# Altium project Fly&Dive.PrjPCB
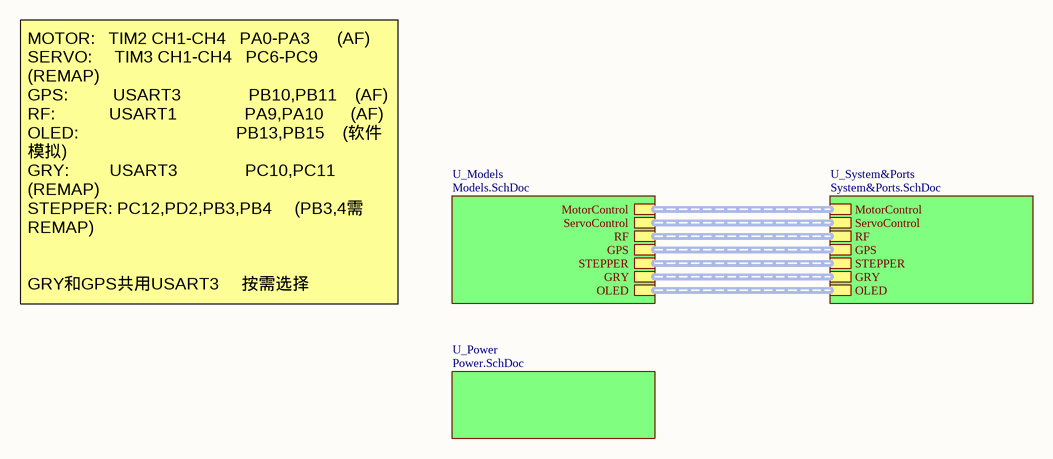
[diagram p0: Board.SchDoc]
4 sheets, 41 parts. Net scope: hierarchical (ports join the sheet entries above them; power ports are global).
Board file: FlyAndDive.PcbDoc
Sheets:
  Board.SchDoc
    U_Models = Models.SchDoc
    U_System&Ports = System&Ports.SchDoc
    U_Power = Power.SchDoc

## Sheet Board.SchDoc
size A4

### Sub-sheets
U_Models = Models.SchDoc: MotorControl (harness MOTOR), ServoControl (harness SERO), RF (harness RF), GPS (harness GPS), STEPPER (harness STEPPER), GRY (harness GRY), OLED (harness OLED)
U_Power = Power.SchDoc: no entries
U_System&Ports = System&Ports.SchDoc: MotorControl (harness MOTOR), ServoControl (harness SERO), RF (harness RF), GPS (harness GPS), STEPPER (harness STEPPER), GRY (harness GRY), OLED (harness OLED)

### Buses and harness runs
harness sheet U_Models/GPS = sheet U_System&Ports/GPS
harness sheet U_Models/GRY = sheet U_System&Ports/GRY
harness sheet U_Models/MotorControl = sheet U_System&Ports/MotorControl
harness sheet U_Models/OLED = sheet U_System&Ports/OLED
harness sheet U_Models/RF = sheet U_System&Ports/RF
harness sheet U_Models/ServoControl = sheet U_System&Ports/ServoControl
harness sheet U_Models/STEPPER = sheet U_System&Ports/STEPPER

### Notes on the sheet
- MOTOR:   TIM2 CH1-CH4   PA0-PA3      (AF)
  SERVO:     TIM3 CH1-CH4   PC6-PC9      (REMAP)
  GPS:          USART3               PB10,PB11    (AF)
  RF:            USART1               PA9,PA10      (AF)
  OLED:                                   PB13,PB15    (软件模拟)
  GRY:         USART3               PC10,PC11  (REMAP)
  STEPPER: PC12,PD2,PB3,PB4     (PB3,4需REMAP)
  GRY和GPS共用USART3     按需选择

## Sheet Models.SchDoc
size A4
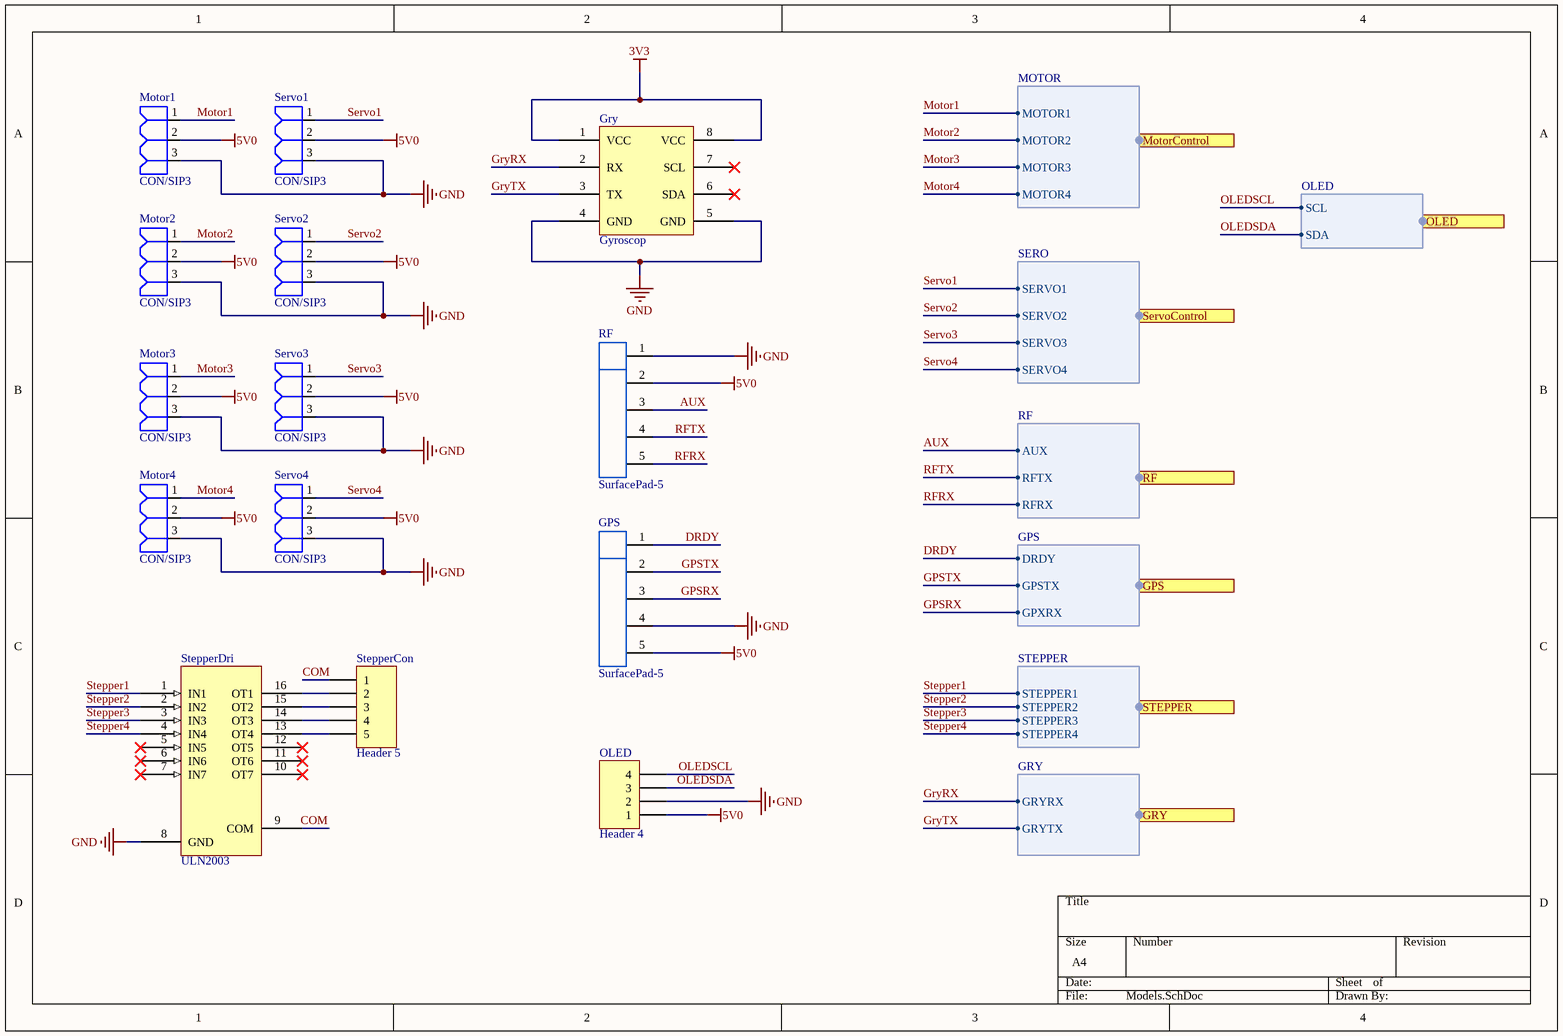
[diagram p1: Models.SchDoc]

### Parts
GPS  SurfacePad-5  [SurfacePad-5]
Gry  Gyroscop  [串口陀螺仪]
Motor1  CON/SIP3  [HDR1X3]
Motor2  CON/SIP3  [HDR1X3]
Motor3  CON/SIP3  [HDR1X3]
Motor4  CON/SIP3  [HDR1X3]
OLED  Header 4  [HDR1X4]
RF  SurfacePad-5  [SurfacePad-5]
Servo1  CON/SIP3  [HDR1X3]
Servo2  CON/SIP3  [HDR1X3]
Servo3  CON/SIP3  [HDR1X3]
Servo4  CON/SIP3  [HDR1X3]
StepperCon  Header 5  [HDR1X5]
StepperDri  ULN2003  [SOIC16]

### Ports
GPS (harness GPS), GRY (harness GRY), MotorControl (harness MOTOR), OLED (harness OLED), RF (harness RF), ServoControl (harness SERO), STEPPER (harness STEPPER)

### Harnesses
MOTOR: MOTOR1, MOTOR2, MOTOR3, MOTOR4
SERO: SERVO1, SERVO2, SERVO3, SERVO4
RF: AUX, RFTX, RFRX
GPS: DRDY, GPSTX, GPXRX
STEPPER: STEPPER1, STEPPER2, STEPPER3, STEPPER4
GRY: GRYRX, GRYTX
OLED: SCL, SDA

### Nets
3V3: Gry.1(VCC) Gry.8(VCC)
5V0: GPS.5 Motor1.2 Motor2.2 Motor3.2 Motor4.2 OLED.1 RF.2 Servo1.2 Servo2.2 Servo3.2 Servo4.2
GND: GPS.4 Gry.4(GND) Gry.5(GND) Motor1.3 Motor2.3 Motor3.3 Motor4.3 OLED.2 RF.1 Servo1.3 Servo2.3 Servo3.3 Servo4.3 StepperDri.8(GND)
AUX: RF.3 ; port RF.AUX
COM: StepperCon.1 StepperDri.9(COM)
DRDY: GPS.1 ; port GPS.DRDY
GPSRX: GPS.3 ; port GPS.GPXRX
GPSTX: GPS.2 ; port GPS.GPSTX
GryRX: Gry.2(RX) ; port GRY.GRYRX
GryTX: Gry.3(TX) ; port GRY.GRYTX
Motor1: Motor1.1 ; port MotorControl.MOTOR1
Motor2: Motor2.1 ; port MotorControl.MOTOR2
Motor3: Motor3.1 ; port MotorControl.MOTOR3
Motor4: Motor4.1 ; port MotorControl.MOTOR4
OLEDSCL: OLED.4 ; port OLED.SCL
OLEDSDA: OLED.3 ; port OLED.SDA
RFRX: RF.5 ; port RF.RFRX
RFTX: RF.4 ; port RF.RFTX
Servo1: Servo1.1 ; port ServoControl.SERVO1
Servo2: Servo2.1 ; port ServoControl.SERVO2
Servo3: Servo3.1 ; port ServoControl.SERVO3
Servo4: Servo4.1 ; port ServoControl.SERVO4
Stepper1: StepperDri.1(IN1) ; port STEPPER.STEPPER1
Stepper2: StepperDri.2(IN2) ; port STEPPER.STEPPER2
Stepper3: StepperDri.3(IN3) ; port STEPPER.STEPPER3
Stepper4: StepperDri.4(IN4) ; port STEPPER.STEPPER4
NetStepperCon_2: StepperCon.2 StepperDri.16(OT1)
NetStepperCon_3: StepperCon.3 StepperDri.15(OT2)
NetStepperCon_4: StepperCon.4 StepperDri.14(OT3)
NetStepperCon_5: StepperCon.5 StepperDri.13(OT4)

Not connected (* = marked no-connect by the designer): Gry 6(SDA)* 7(SCL)*; StepperDri 5(IN5)* 6(IN6)* 7(IN7)* 10(OT7)* 11(OT6)* 12(OT5)*

### Library data of the parts
Gry = 串口陀螺仪
OLED = Header 4: Header, 4-Pin; LatestRevisionDate: 17-Jul-2002; LatestRevisionNote: Re-released for DXP Platform.; Publisher: Altium Limited
StepperCon = Header 5: Header, 5-Pin; LatestRevisionDate: 17-Jul-2002; LatestRevisionNote: Re-released for DXP Platform.; Publisher: Altium Limited
StepperDri = ULN2003: 驱动IC

## Sheet System&Ports.SchDoc
size A4
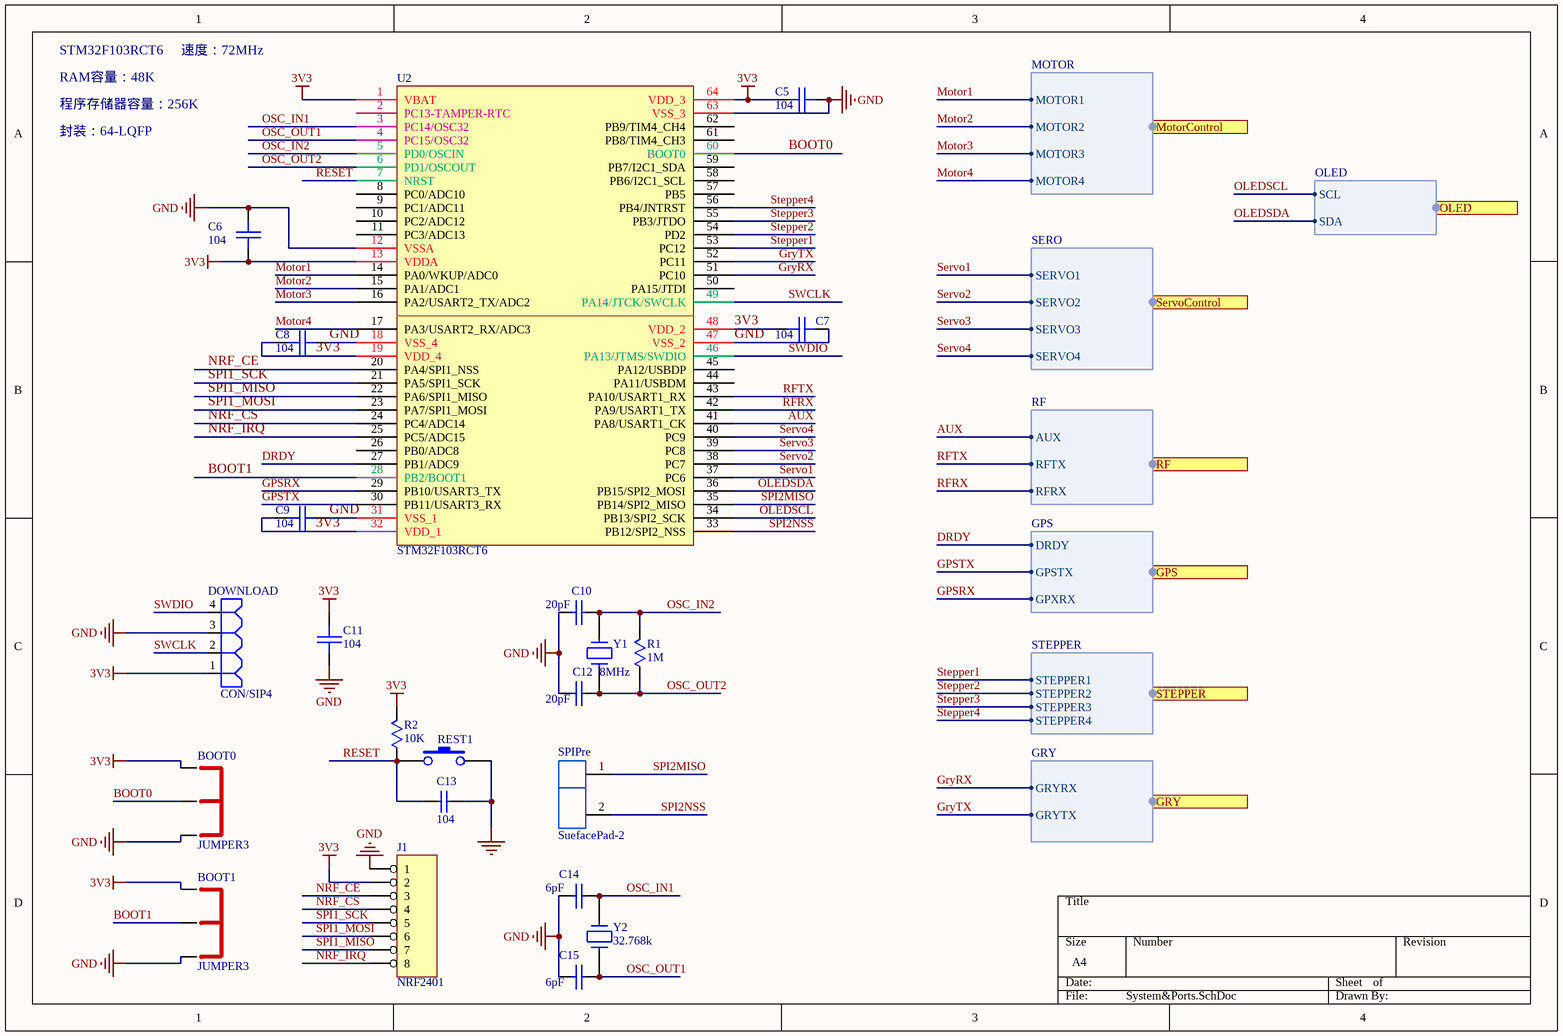
[diagram p2: System&Ports.SchDoc]

### Parts
BOOT0  JUMPER3  [Jumper3]
BOOT1  JUMPER3  [Jumper3]
C5  104  [C0603]
C6  104  [C0603]
C7  104  [C0603]
C8  104  [C0603]
C9  104  [C0603]
C10  20pF  [LC-0603_C]
C11  104  [C0603]
C12  20pF  [LC-0603_C]
C13  104  [LC-0603_C]
C14  6pF  [LC-0603_C]
C15  6pF  [LC-0603_C]
DOWNLOAD  CON/SIP4  [HDR1X4]
J1  NRF2401  [HDR2X4]
R1  1M  [LC-0603_R]
R2  10K  [R0603]
REST1  (no value)  [KEY-K2]
SPIPre  SuefacePad-2  [SurfacePad-2]
U2  STM32F103RCT6  [LC-LQFP-64_10x10x05P]
Y1  8MHz  [XTAL-49/S_N]
Y2  32.768k  [XTAL_2X6 卧式]

### Ports
GPS (harness GPS), GRY (harness GRY), MotorControl (harness MOTOR), OLED (harness OLED), RF (harness RF), ServoControl (harness SERO), STEPPER (harness STEPPER)

### Harnesses
MOTOR: MOTOR1, MOTOR2, MOTOR3, MOTOR4
SERO: SERVO1, SERVO2, SERVO3, SERVO4
RF: AUX, RFTX, RFRX
GPS: DRDY, GPSTX, GPXRX
STEPPER: STEPPER1, STEPPER2, STEPPER3, STEPPER4
GRY: GRYRX, GRYTX
OLED: SCL, SDA

### Nets
3V3: BOOT0.1 BOOT1.1 C5.1 C6.2 C7.1 C8.1 C9.1 C11.1 DOWNLOAD.1 J1.2 R2.2 U2.1(VBAT) U2.13(VDDA) U2.19(VDD_4) U2.32(VDD_1) U2.48(VDD_2) U2.64(VDD_3)
GND: BOOT0.3 BOOT1.3 C5.2 C6.1 C7.2 C8.2 C9.2 C10.1 C11.2 C12.1 C13.1 C14.1 C15.1 DOWNLOAD.3 J1.1 REST1.2 U2.12(VSSA) U2.18(VSS_4) U2.31(VSS_1) U2.47(VSS_2) U2.63(VSS_3)
AUX: U2.41(PA8/USART1_CK) ; port RF.AUX
BOOT0: BOOT0.2 U2.60(BOOT0)
BOOT1: BOOT1.2 U2.28(PB2/BOOT1)
DRDY: U2.27(PB1/ADC9) ; port GPS.DRDY
GPSRX: U2.29(PB10/USART3_TX) ; port GPS.GPXRX
GPSTX: U2.30(PB11/USART3_RX) ; port GPS.GPSTX
GryRX: U2.51(PC10) ; port GRY.GRYRX
GryTX: U2.52(PC11) ; port GRY.GRYTX
Motor1: U2.14(PA0/WKUP/ADC0) ; port MotorControl.MOTOR1
Motor2: U2.15(PA1/ADC1) ; port MotorControl.MOTOR2
Motor3: U2.16(PA2/USART2_TX/ADC2) ; port MotorControl.MOTOR3
Motor4: U2.17(PA3/USART2_RX/ADC3) ; port MotorControl.MOTOR4
NRF_CE: J1.3 U2.20(PA4/SPI1_NSS)
NRF_CS: J1.4 U2.24(PC4/ADC14)
NRF_IRQ: J1.8 U2.25(PC5/ADC15)
OLEDSCL: U2.34(PB13/SPI2_SCK) ; port OLED.SCL
OLEDSDA: U2.36(PB15/SPI2_MOSI) ; port OLED.SDA
OSC_IN1: C14.2 U2.3(PC14/OSC32) Y2.2
OSC_IN2: C10.2 R1.2 U2.5(PD0/OSCIN) Y1.1
OSC_OUT1: C15.2 U2.4(PC15/OSC32) Y2.1
OSC_OUT2: C12.2 R1.1 U2.6(PD1/OSCOUT) Y1.2
RESET: C13.2 R2.1 REST1.1 U2.7(NRST)
RFRX: U2.42(PA9/USART1_TX) ; port RF.RFRX
RFTX: U2.43(PA10/USART1_RX) ; port RF.RFTX
Servo1: U2.37(PC6) ; port ServoControl.SERVO1
Servo2: U2.38(PC7) ; port ServoControl.SERVO2
Servo3: U2.39(PC8) ; port ServoControl.SERVO3
Servo4: U2.40(PC9) ; port ServoControl.SERVO4
SPI1_MISO: J1.7 U2.22(PA6/SPI1_MISO)
SPI1_MOSI: J1.6 U2.23(PA7/SPI1_MOSI)
SPI1_SCK: J1.5 U2.21(PA5/SPI1_SCK)
SPI2MISO: SPIPre.1 U2.35(PB14/SPI2_MISO)
SPI2NSS: SPIPre.2 U2.33(PB12/SPI2_NSS)
Stepper1: U2.53(PC12) ; port STEPPER.STEPPER1
Stepper2: U2.54(PD2) ; port STEPPER.STEPPER2
Stepper3: U2.55(PB3/JTDO) ; port STEPPER.STEPPER3
Stepper4: U2.56(PB4/JNTRST) ; port STEPPER.STEPPER4
SWCLK: DOWNLOAD.2 U2.49(PA14/JTCK/SWCLK)
SWDIO: DOWNLOAD.4 U2.46(PA13/JTMS/SWDIO)

Not connected (* = marked no-connect by the designer): U2 2(PC13-TAMPER-RTC) 8(PC0/ADC10) 9(PC1/ADC11) 10(PC2/ADC12) 11(PC3/ADC13) 26(PB0/ADC8) 44(PA11/USBDM) 45(PA12/USBDP) 50(PA15/JTDI) 57(PB5) 58(PB6/I2C1_SCL) 59(PB7/I2C1_SDA) 61(PB8/TIM4_CH3) 62(PB9/TIM4_CH4)

### Notes on the sheet
- STM32F103RCT6
- 程序存储器容量：256K
- RAM容量：48K
- 速度：72MHz
- 封装：64-LQFP

### Library data of the parts
BOOT0 BOOT1 = JUMPER3: Jumper
C5-C9 C11 = CAP
C10 C12 = CAP: CAP CHIP 20P 50V(+-5% C0G 0603); Value: 20pF
C13 = CAP: GRM39 X7R102K50PT; Value: 100pF; Published: 8-Jun-2000; Revision: July-2002: Re-released for DXP Platform.; Publisher: Altium Limited; REF: GRM39 X7R102K50PT
C14 C15 = CAP: CAP CHIP 20P 50V(+-5% C0G 0603); Value: 20pF
J1 = HEADER 8: 8 Pin Header
R1 R2 = RES
REST1 = SW-PB
SPIPre = SurfacePad-2
U2 = STM32F103RBT6
Y1 Y2 = CRYSTAL: Crystal 8MHz PLUG; Value: 8MHz

## Sheet Power.SchDoc
size A4
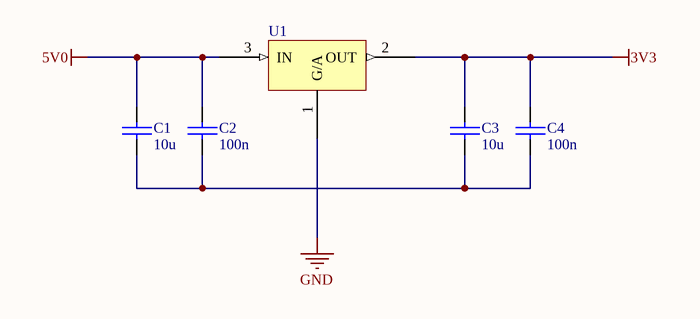
[diagram p3: Power.SchDoc]

### Parts
C1  10u  [C0805]
C2  100n  [C0603]
C3  10u  [C0805]
C4  100n  [C0603]
U1  AMS1117-XX  [SOT223]  (value not drawn)

### Nets
3V3: C3.1 C4.1 U1.2(OUT)
5V0: C1.1 C2.1 U1.3(IN)
GND: U1.1(G/A)
NetC1_2: C1.2 C2.2 C3.2 C4.2

### Library data of the parts
C1-C4 = Capacitor: 电容
U1 = AMS1117-XX: 稳压芯片

## Nets that join several sheets
3V3: Models (Gry.1 Gry.8), System&Ports (17 pins), Power (C3.1 C4.1 U1.2)
5V0: Models (11 pins), Power (C1.1 C2.1 U1.3)
GND: Models (14 pins), System&Ports (21 pins), Power (U1.1)
AUX: Models (RF.3), System&Ports (U2.41)
DRDY: Models (GPS.1), System&Ports (U2.27)
GPSRX: Models (GPS.3), System&Ports (U2.29)
GPSTX: Models (GPS.2), System&Ports (U2.30)
GryRX: Models (Gry.2), System&Ports (U2.51)
GryTX: Models (Gry.3), System&Ports (U2.52)
Motor1: Models (Motor1.1), System&Ports (U2.14)
Motor2: Models (Motor2.1), System&Ports (U2.15)
Motor3: Models (Motor3.1), System&Ports (U2.16)
Motor4: Models (Motor4.1), System&Ports (U2.17)
OLEDSCL: Models (OLED.4), System&Ports (U2.34)
OLEDSDA: Models (OLED.3), System&Ports (U2.36)
RFRX: Models (RF.5), System&Ports (U2.42)
RFTX: Models (RF.4), System&Ports (U2.43)
Servo1: Models (Servo1.1), System&Ports (U2.37)
Servo2: Models (Servo2.1), System&Ports (U2.38)
Servo3: Models (Servo3.1), System&Ports (U2.39)
Servo4: Models (Servo4.1), System&Ports (U2.40)
Stepper1: Models (StepperDri.1), System&Ports (U2.53)
Stepper2: Models (StepperDri.2), System&Ports (U2.54)
Stepper3: Models (StepperDri.3), System&Ports (U2.55)
Stepper4: Models (StepperDri.4), System&Ports (U2.56)